# EAGLE schematic Model train - Speedometer - Sender (EAGLE 6.5.0)
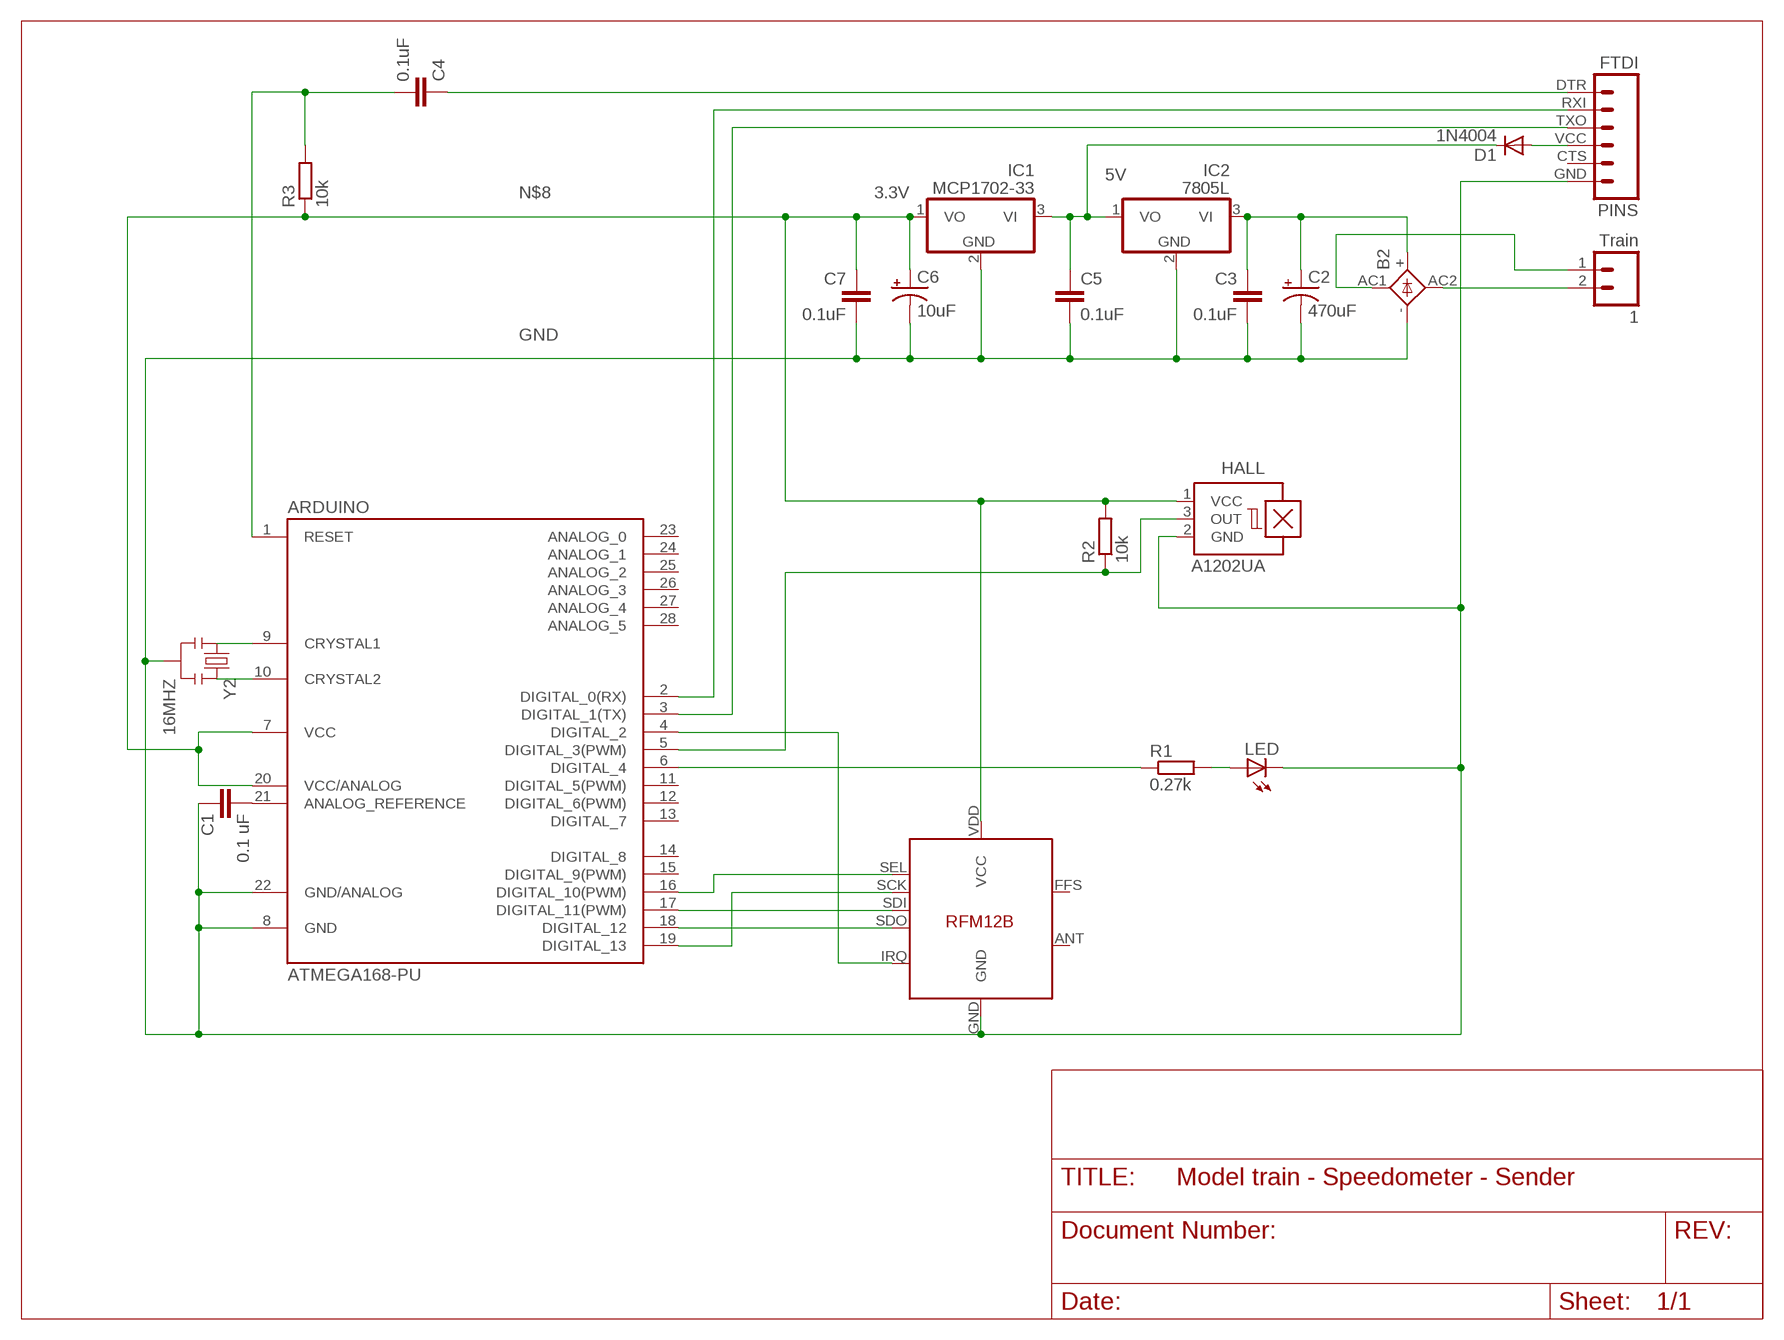
[diagram p0: schematic, sheet 1]

## Parts
1  Train  M02-JST-2-PTH-NO_SILK  [JST-2-PTH-NS]
ARDUINO  ATMEGA168-PU  [DIL28-3]
B2  1KAB  [1KAB]
C1  0.1 uF  C-EU025-025X050  [C025-025X050]
C2  470uF  CAP_POL  [CPOL-RADIAL-100UF-25V-150MIL]
C3  0.1uF  C-EU025-025X050  [C025-025X050]
C4  0.1uF  C-EU025-025X050  [C025-025X050]
C5  0.1uF  C-EU025-025X050  [C025-025X050]
C6  10uF  CAP_POL  [CPOL-RADIAL-100UF-25V-150MIL]
C7  0.1uF  C-EU025-025X050  [C025-025X050]
D1  1N4004  [DO41-10]
HALL  A1202UA  [SIP3-UA]
IC1  MCP1702-33  7805L  [TO92]
IC2  7805L  [TO92]
LED  U57X32  [U57X32]
PINS  FTDI  FTDI_BASICPTH  [FTDI_BASIC]
R1  0.27k  R-EU_0204/2V  [0204V]
R2  10k  R-EU_0204/2V  [0204V]
R3  10k  R-EU_0204/2V  [0204V]
U$2  RFM12B  [RFM12B]
Y2  16MHZ  RESONATOR16MHZ  [RESONATOR-SMD]

## Nets
3.3V: C6.1(+) C7.1 IC1.1(VO)
5V: C5.1 D1.C IC1.3(VI) IC2.1(VO)
GND: ARDUINO.8(GND) ARDUINO.22(GND/ANALOG) B2.- C1.1 C2.2(-) C3.2 C5.2 C6.2(-) C7.2 HALL.2(GND) IC1.2(GND) IC2.2(GND) LED.K(C) PINS.GND U$2.GND Y2.2
N$1: ARDUINO.4(DIGITAL_2) U$2.IRQ
N$2: ARDUINO.16(DIGITAL_10(PWM)) U$2.SEL
N$3: ARDUINO.19(DIGITAL_13) U$2.SCK
N$4: ARDUINO.17(DIGITAL_11(PWM)) U$2.SDI
N$5: ARDUINO.18(DIGITAL_12) U$2.SDO
N$6: ARDUINO.9(CRYSTAL1) Y2.1
N$7: ARDUINO.10(CRYSTAL2) Y2.3
N$8: ARDUINO.7(VCC) ARDUINO.20(VCC/ANALOG) HALL.1(VCC) R2.2 R3.1 U$2.VDD(VCC)
N$9: ARDUINO.6(DIGITAL_4) R1.1
N$10: ARDUINO.21(ANALOG_REFERENCE) C1.2
N$11: ARDUINO.1(RESET)
N$12: ARDUINO.2(DIGITAL_0(RX)) PINS.RXI
N$13: ARDUINO.3(DIGITAL_1(TX)) PINS.TXO
N$15: 1.2 B2.AC2
N$16: D1.A PINS.VCC
N$17: LED.A R1.2
N$18: B2.+ C2.1(+) C3.1 IC2.3(VI)
N$19: C4.2 R3.2
N$21: 1.1 B2.AC1
N$22: ARDUINO.5(DIGITAL_3(PWM)) HALL.3(OUT) R2.1
N$25: C4.1 PINS.DTR
Unconnected: ARDUINO.11(DIGITAL_5(PWM)) ARDUINO.12(DIGITAL_6(PWM)) ARDUINO.13(DIGITAL_7) ARDUINO.14(DIGITAL_8) ARDUINO.15(DIGITAL_9(PWM)) ARDUINO.23(ANALOG_0) ARDUINO.24(ANALOG_1) ARDUINO.25(ANALOG_2) ARDUINO.26(ANALOG_3) ARDUINO.27(ANALOG_4) ARDUINO.28(ANALOG_5) PINS.CTS U$2.ANT U$2.FFS

## Library data of the parts
1 = SparkFun-Connectors:M02: Standard 2-pin 0.1" header. Use with - straight break away headers ( PRT-00116) - right angle break away headers (PRT-00553) - swiss pins (PRT-00743) - machine pins (PRT-00117) - female headers (PRT-00115) Molex polarized connector foot print use with: PRT-08233 with associated crimp pins and housings. 2.54_SCREWTERM for use with PRT-10571. 3.5mm Screw Terminal footprints for PRT-08084 5mm Screw Terminal footprints for use with PRT-08433
ARDUINO = Arduino-AVR:ATMEGA168-PU
B2 = rectifier:1KAB: RECTIFIER grid 5,08 x 5,08 mm
C1 C3-C5 C7 = rcl:C-EU: CAPACITOR, European symbol
C2 C6 = SteveMarple:CAP_POL: Capacitor Polarized These are standard SMD and PTH capacitors. Normally 10uF, 47uF, and 100uF in electrolytic and tantalum varieties. Always verify the external diameter of the through hole cap, it varies with capacity, voltage, and manufacturer. The EIA devices should be standard.
D1 = diode:1N4004: DIODE general purpose rectifier, 1 A
HALL = allegro:A12*?: Hall-effect bipolar switch Source: http://www.allegromicro.com/en/Products/Part_Numbers/1202/1202.pdf; OC_FARNELL: unknown; OC_NEWARK: unknown
IC1 IC2 = linear:78*: Positive VOLTAGE REGULATOR Source: http://cache.national.com/ds/LM/LM78L05.pdf http://www.fairchildsemi.com/ds/LM/LM7805.pdf
LED = led:U57X32: LED rectangle, 5.7 x 3.2 mm
PINS = SparkFun-Connectors:FTDI_BASIC: FTDI Basic header with labels
R1-R3 = resistor:R-EU_: RESISTOR, European symbol
U$2 = JeeParts:RFM12B
Y2 = SparkFun-FreqCtrl:RESONATOR: Resonator Small SMD resonator. Used, eg, on the Arduino Pro/ Pro Mini boards. 8MHz- XTAL-08895 16MHz- XTAL-08900; PROD_ID: XTAL-08900